# Altium schematic sheet APD_flex_R02.SchDoc
size A3
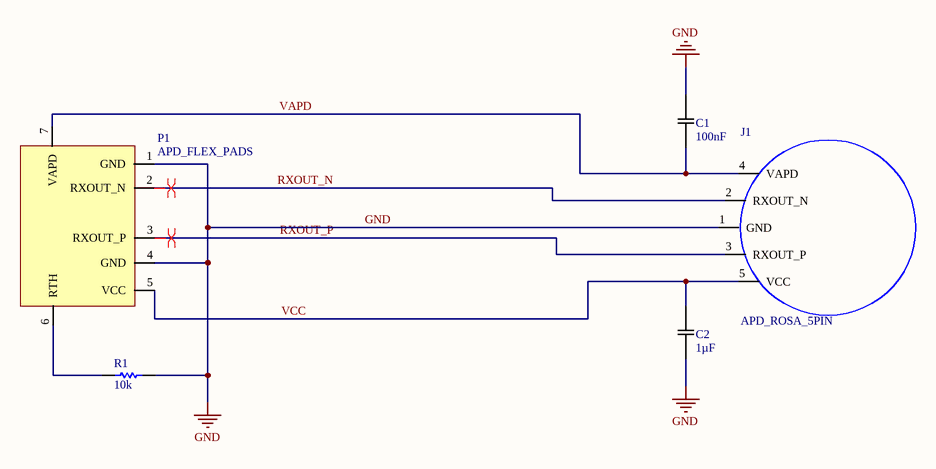
[diagram p0: APD_flex_R02.SchDoc]

## Parts
C1  100nF  [0603]
C2  1µF  [0402]
J1  APD_ROSA_5PIN  [APD_5PINS - Pin F]
P1  APD_FLEX_PADS  [FLEX_7PADS - new_design]
R1  10k  [0402]

## Nets
GND: C1.2 C2.2 J1.1(GND) P1.1(GND) P1.4(GND) R1.2
RXOUT_N: J1.2(RXOUT_N) P1.2(RXOUT_N)
RXOUT_P: J1.3(RXOUT_P) P1.3(RXOUT_P)
VAPD: C1.1 J1.4(VAPD) P1.7(VAPD)
VCC: C2.1 J1.5(VCC) P1.5(VCC)
NetP1_6: P1.6(RTH) R1.1

## Layout directives
differential pair: RXOUT_N, RXOUT_P

## Library data of the parts
C1 = CAP_100nF_0603: 100nF_0603; Manufacturer: Murata Electronics North America; Manufacturer Part Number: GRM188R72A104KA35D; Voltage: 100V; Supplier: Digi-Key; Value: 100nF; Supplier Part Number: 490-3285-2-ND
C2 = CAP_1µF_0402: 1µF_0402; Manufacturer: Samsung Electro-Mechanics; Manufacturer Part Number: CL05A105KP5NNNC; Value: 1uF; Voltage: 10V; Supplier: Digi-Key; Supplier Part Number: 1276-1076-2-ND
R1 = RES_10k_0402: 10K_0402_Termistor; Manufacturer: Vishay BC Components; Manufacturer Part Number: NTCS0402E3103FLT; Supplier Part Number: BC2534TR-ND; Supplier: Digi-Key; Value: 10k